# Altium project Drone Project.PrjPcb
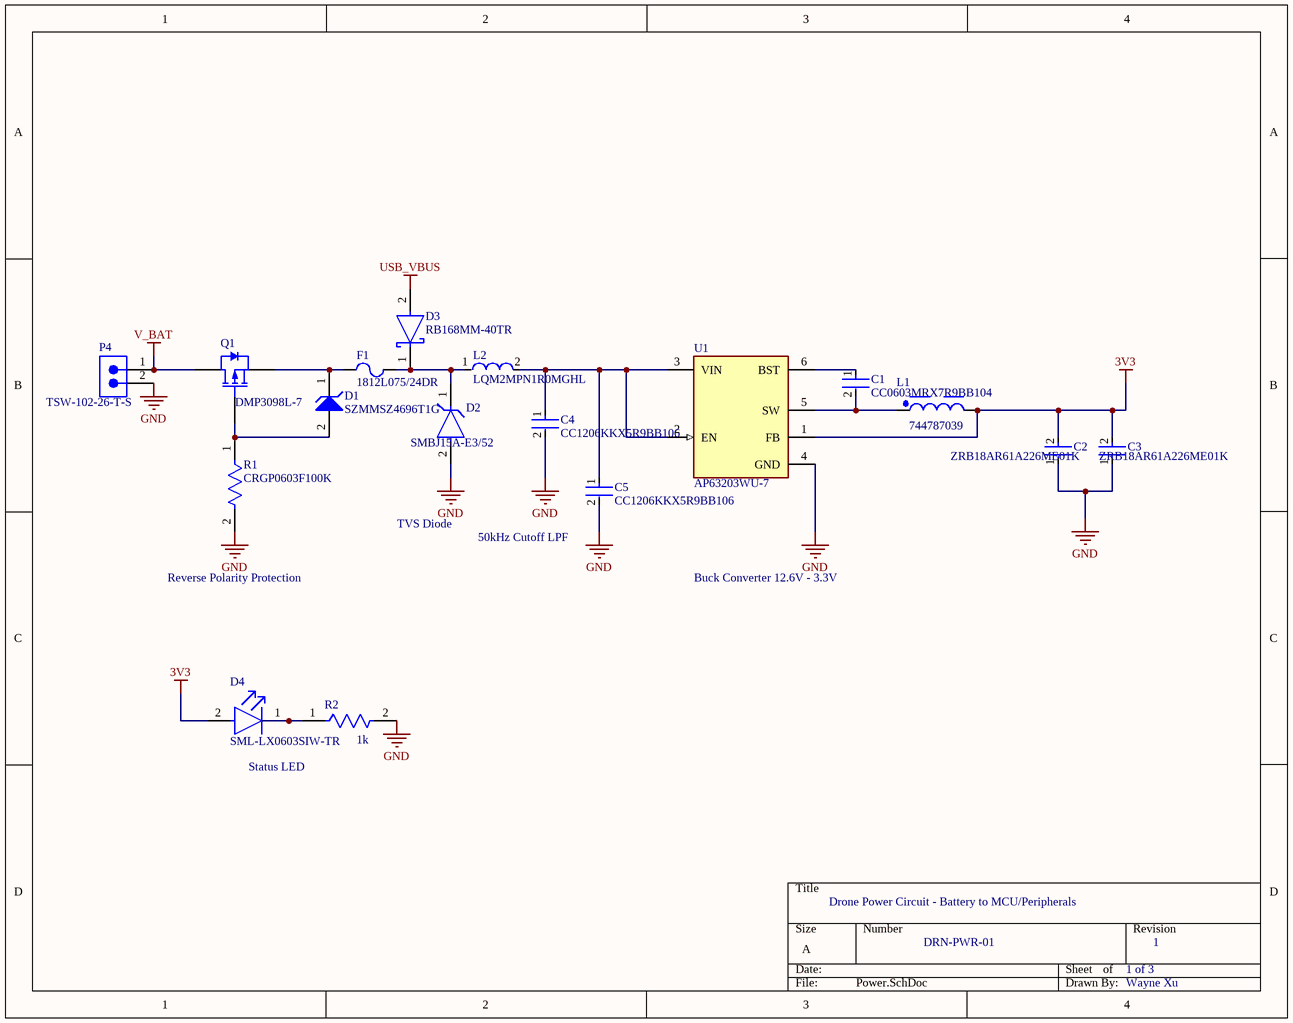
[diagram p0: Power.SchDoc]
3 sheets, 49 parts. Net scope: flat (ports and power ports of the same name join across sheets).
Board files: Drone Project.PcbDoc, PCB1.PcbDoc
Sheets:
  Power.SchDoc
  MCU.SchDoc
  Connectors.SchDoc

## Sheet Power.SchDoc
size A; SheetNumber: 1; SheetTotal: 3

### Parts
C1  CC0603MRX7R9BB104  [FP-CC0603-DA-MFG]
C2  ZRB18AR61A226ME01K  [FP-ZRB18A-0_2-MFG]
C3  ZRB18AR61A226ME01K  [FP-ZRB18A-0_2-MFG]
C4  CC1206KKX5R9BB106  [FP-CC1206-FD-MFG]
C5  CC1206KKX5R9BB106  [FP-CC1206-FD-MFG]
D1  SZMMSZ4696T1G  [ONSC-SOD-123-2-425-04_V]
D2  SMBJ15A-E3/52  [FP-95401-MFG]
D3  RB168MM-40TR  [FP-PMDU-MFG]
D4  SML-LX0603SIW-TR  [FP-SML-LX0603SIW-TR-MFG]
F1  1812L075/24DR  [LFUS-1812L07524DR_V]
L1  744787039  [WE-PD2SR_7850]
L2  LQM2MPN1R0MGHL  [FP-LQM2MPN_GH-MFG]
P4  TSW-102-26-T-S  [SMTC-TSW-102-26-XX-S]
Q1  DMP3098L-7  [DIOD-SOT23-3_V]
R1  CRGP0603F100K  [FP-CRGP0603-IPC_C]
R2  1k  [FP-CRGCQ0402-IPC_C]
U1  AP63203WU-7  [FP-TSOT26-MFG]

### Nets
3V3: C2.2 C3.2 D4.2(A) L1.2 U1.1(FB)
GND: C2.1 C3.1 C4.2 C5.2 D2.2(A) P4.2 R1.2 R2.2 U1.4(GND)
USB_VBUS: D3.2(A)
V_BAT: P4.1 Q1.3(D)
NetC1_1: C1.1 U1.6(BST)
NetC1_2: C1.2 L1.1 U1.5(SW)
NetC4_1: C4.1 C5.1 L2.2 U1.2(EN) U1.3(VIN)
NetD1_1: D1.1(K) F1.1 Q1.2(S)
NetD1_2: D1.2(A) Q1.1(G) R1.1
NetD2_1: D2.1(C) D3.1(C) F1.2 L2.1
NetD4_1: D4.1(C) R2.1

### Notes on the sheet
- TVS Diode
- (near C5) 50kHz Cutoff LPF
- Reverse Polarity Protection
- Buck Converter 12.6V - 3.3V
- Status LED
- Drone Power Circuit - Battery to MCU/Peripherals
- DRN-PWR-01
- 1 of 3
- 1
- Wayne Xu

### Library data of the parts
C1 = CMP-03422-000537-1: CAP CER 0.1UF 50V X7R 0603; Manufacturer: YAGEO; Material: Ceramic; Capacitance: 100 nF; Temperature Coefficient: 15%; Tolerance: 0.2; Value: 100 nF; Temperature Range Low: -55°C; Height: 0.9mm; Temperature Range High: +125°C; Category: Cap; Package: CC0603-DA; Mouser Description: Cap Ceramic 50V 20% +Tol 20% -Tol X7R 15% TC 0.1uF SMD 0603; Temperature Characteristic: X7R; Footprint Url: http://www.yageo.com/exep/pages/download/literatures/UPY-C_GEN_24.pdf; Octopart: https://octopart.com/cc0603mrx7r9bb104-yageo-67308423; RoHS: TRUE; Voltage: 50 V; Manufacturer Part Number: CC0603MRX7R9BB104; Lead Free: Yes; ComponentLink2URL: http://www.yageo.com/documents/recent/UPY-GPHC_X7R_6.3V-to-50V_18.pdf; ComponentLink2Description: Datasheet; Digikey Description: CAP CER 0.1UF 50V X7R 0603; Device Class L2: Capacitors; Automotive: No; Voltage Rating: 50 V; Temperature: -55°C to +125°C; Device Class L1: Passive Components; Device Class L3: Ceramic Capacitors
C2 C3 = CMP-06035-026751-1: CAP CER MLCC
C4 C5 = CMP-03422-001420-1: CAP CER 10UF 50V X5R 1206; Tolerance: 10%; Voltage Rating (DC): 50V; Width: 0.063inch; Halogen Free: Halogen Free; Mount: Surface Mount; Dielectric: X5R; Max Operating Temperature: 85°C; Capacitance: 10uF; Case/Package: 1206; Voltage Rating: 50V; Lead Free: Lead Free; Thickness: 0.075inch; Min Operating Temperature: -55°C; Length: 0.126inch; Packaging: Tape and Reel; RoHS Compliant: Yes
D1 = CMP-1060-00433-1: Zener Voltage Regulator, 500 mW, 2-Pin SOD-123, Pb-Free, Tape and Reel; Manufacturer: On Semiconductor; VZ Typ (V): 9.1; P Max (W): 0.5; PartNumber: SZMMSZ4696T1G; PackageVersion: Rev. G, 10/2009; ComponentLink1URL: http://www.onsemi.com/; ComponentLink1Description: Manufacturer URL; PackageDescription: 2-Pin SOD, Body 1.6 x 2.69 mm; ComponentLink2URL: http://www.onsemi.com/pub_link/Collateral/MMSZ4678T1-D.PDF; DatasheetVersion: Rev. 9; Packing: Tape and Reel; PackageReference: SOD-123-2-425-04; ComponentLink3URL: http://www.onsemi.com/pub_link/Collateral/425-04.PDF; ComponentLink2Description: Datasheet; RoHS: Pb-Free; Mounting Technology: Surface Mount; ComponentLink3Description: Package Specification
D2 = CMP-02577-000009-1: TVS DIODE 15V 24.4V DO214AA; Manufacturer: Vishay; Standoff Height: 0mm; Number Of Channels: 1; Max Junction Temp: +150°C; Breakdown Voltage: 16.7V; Peak Pulse Power: 600W; Peak Pulse Current: 24.6A; Direction: Unidirectional; Category: Diode; Reverse Standoff Voltage: 15V; Manufacturer Part Number: SMBJ15A-E3/52; Package: 95401; Temperature: -55°C to +150°C; Automotive: No; ComponentLink2Description: Datasheet; Temperature Range High: +150°C; ComponentLink2URL: https://www.vishay.com/docs/88392/smbj.pdf; Temperature Range Low: -55°C; Digikey Description: TVS DIODE 15V 24.4V DO214AA; Device Class L1: Circuit Protection; Mouser Description: TVS Diodes - Transient Voltage Suppressors 600W 15V 5% Uni; RoHS: TRUE; Device Class L2: TVS Diodes; Footprint Url: https://www.vishay.com/docs/95401/smb.pdf; Clamping Voltage: 24.4V; Octopart: https://octopart.com/smbj15a-e3%2F52-vishay-39558613; Lead Free: Yes; Device Class L3: unset; Height: 2.44mm
D3 = CMP-08971-000002-1: DIODE SCHOTTKY 40V 1A PMDU; Manufacturer: Rohm; Peak Reverse Current: 0.05uA; Max Surge Forward Current: 40A; Max Junction Temp: +150°C; ComponentLink2URL: https://www.rohm.com/datasheet/RB168MM-40/rb168mm-40tr-e; Manufacturer Part Number: RB168MM-40TR; Mouser Description: Schottky Diodes & Rectifiers 40V-VR 1A-IO 30A-IFSM; Reverse Voltage: 40V; Package: PMDU; Forward Current: 1A; Height: 0.9mm; Device Class L1: Discrete Semiconductors; Octopart: https://octopart.com/rb168mm-40tr-rohm-65063949; Digikey Description: DIODE SCHOTTKY 40V 1A PMDU; Lead Free: Yes; Temperature: to +150°C; RoHS: TRUE; Temperature Range High: +150°C; Max Repetitive Reverse Voltage: 40V; Device Class L2: Diodes; Automotive: No; Category: Diode; Device Class L3: Schottky Diodes; ComponentLink2Description: Datasheet
D4 = CMP-57192-000009-1: LED RED DIFFUSED SMD; Test Current: 20mA; Forward Voltage: 2V; Approvals: UL; Dominant Wavelength: 636nm; Viewing Angle: 140°; Lens Color: White; Luminous Intensity: 60mcd; Power Rating: 50mW; Number of LEDs: 1; Color: Red; Forward Current: 20mA; Moisture Sensitivity Level: 2; Case Code (Imperial): 0603; Lead Free: Lead Free; Lens Transparency: Diffused; Case Code (Metric): 1608; Height: 0.6mm; Max Operating Temperature: 85°C; Width: 0.8mm; Lens Style: Diffused; Illumination Color: Red; Wavelength: 636nm; REACH SVHC: No SVHC; Package Quantity: 1; RoHS Compliant: Yes; Case/Package: 0603; Number of Pins: 2; Packaging: Tape and Reel; Length: 1.6mm; Mount: Surface Mount; Min Operating Temperature: -25°C
F1 = CMP-2000-05510-1: Poly-Fuse(R) Resettable PTC, 24 V, 100 A, -40 to 85 degC, 2-Pin SMD, RoHS, Tape and Reel; Manufacturer: Littelfuse; Resistance: 290mOhms; Current Rating - Max: 100A; Maximum Voltage: 24VDC; Hold Current: 0.75A; Trip Current: 1.5A; Maximum Voltage DC: 24V; Type: PolyFuseResettablePTC; Datasheet Version: 02/2016; Package / Case: 1812(4532metric); Mounting Technology: SurfaceMount; Packaging: Reel; Package Description: 2-Pin Surface Mount Device, Body 4.55 x 3.24 mm; Brand: Littelfuse; Manufacturer URL: http://www.littelfuse.com/; Mounting Style: SMD/SMT; Dimensions: 4.37mmLx3.07mmWx0.75mmH; Operating Temperature Range: -40Cto+85C; Product Category: ResettableFuses-PPTC; Current Rating: 100A; Termination Style: SMD/SMT; Factory Pack Quantity: 1500; Current Rating (Max): 100A; Package Reference: 1812L07524DR; RoHS: Details; Series: 1812L; Datasheet URL: http://www.littelfuse.com/~/media/electronics/datasheets/resettable_ptcs/littelfuse_ptc_1812l_datasheet.pdf.pdf
L1 = CMP-1397-00011-3: Fixed Ind 3.9UH 3.8A 20 Mohm SMD; Core Material: Composite, Ferrite; Inductance: 3.9µH; Series Resistance: 16.7mΩ; Tolerance: 30%; Test Frequency: 100kHz; Shielding: Shielded; Self Resonant Frequency: 45MHz; Saturation Current: 4A; Number of Pins: 2; Max Operating Temperature: 125°C; Mount: Surface Mount; Length: 7.8mm; DC Resistance (DCR): 16.7mΩ; Case/Package: SMD/SMT; Min Operating Temperature: -40°C; Width: 7mm; REACH SVHC: Unknown; RMS Current (Irms): 3.8A; Max DC Current: 3.8A; Composition: Wirewound; Termination: SMD/SMT; Inductance Tolerance: 30%; Ambient Temperature Range High: 85°C; Ambient Temperature Range Low: -40°C; Depth: 7mm; Height - Seated (Max): 4.4958mm; RoHS: Compliant; Height: 4.8mm; Current Rating: 3.8A
L2 = CMP-06042-016377-1: FIXED IND 1UH 1.9A 80 MOHM SMD; Self Resonant Frequency: 60MHz; Tolerance: 20%; Shielding: Shielded; Saturation Current: 2A; Core Material: Ferrite; Test Frequency: 1MHz; DC Resistance (DCR): 80mR; Width: 1.6mm; Inductance: 1uH; Case Code (Metric): 2016; Package Quantity: 3000; Lead Free: Contains Lead; Height - Seated (Max): 0.039inch; Max Operating Temperature: 85°C; Height: 0.9mm; RoHS Compliant: Yes; Min Operating Temperature: -40°C; Length: 0.079inch; Case Code (Imperial): 0806; Packaging: Tape and Reel; Mount: Surface Mount; Case/Package: 0806; Max DC Current: 1.9A; Termination: SMD/SMT; Current Rating: 1.9A
P4 = CMP-1024-00328-1: 0.025" SQ Post Header, Through-hole, Vertical, -55 to 105 degC, 2.54 mm Pitch, 2-Pin, Male, RoHS; Manufacturer: Samtec; Pitch: 2.54 mm; PackageReference: TSW-102-26-XX-S; ComponentLink1URL: http://www.samtec.com; ComponentLink3Description: Package Specification; ComponentLink3URL: http://www.samtec.com/documents/webfiles/cpdf/TSW-XXX-XX-XXX-X-XX-XXX-MKT.pdf; DatasheetVersion: F-214; ComponentLink2URL: http://www.samtec.com/documents/webfiles/pdf/TSW_TH.PDF; Mounting Technology: Through-hole; ComponentLink2Description: Datasheet; PartNumber: TSW-102-26-T-S; ComponentLink1Description: Manufacturer URL; PackageDescription: .025[0.64] SQ. Post Terminal Strip Assembly; Orientation: Vertical; PackageVersion: DM, 8/1988; Temperature Range: -55 to 105 degC; RoHS: True
Q1 = CMP-0697-00001-2: P-Channel Enhancement Mode MOSFET, -30 V VDS, -55 to 155 degC, 3-Pin SOT23, RoHS, Tape and Reel; Manufacturer: Diodes Inc; PD (TA: 25 degC)=1.08 W; VGS: +/- 20 V; VDS: -30 V; IDS (TA: 25 degC)=-3.8 A; RDS(on) (Max.) (VGS: 4.5 V)=120 mOhm; VGS(th) (Max.): -2.1 V; ComponentLink3Description: Package Specification; ComponentLink3URL: http://www.diodes.com/datasheets/ap02002.pdf; PackageDescription: 3-Pin Small Outline Transistor, Body 1.3 x 2.9 mm, Pitch 0.95 mm; PackageReference: SOT23; PartNumber: DMP3098L-7; ComponentLink1Description: Manufacturer URL; ComponentLink2Description: Datasheet; ComponentLink2URL: http://www.diodes.com/datasheets/ds31447.pdf; ComponentLink1URL: http://www.diodes.com/; DatasheetVersion: Rev. 8 - 2; Mounting Technology: Surface Mount; RoHS: TRUE; Packing: Tape and Reel; PackageVersion: Rev. 75; Operating Temperature Range: -55 to 150 degC
R1 = CMP-03211-000885-1: CRGP 0603 100K 1%; Manufacturer: TE; Power Rating: 0.25W; Resistance: 100KΩ; Voltage Rating: 50V; Value: 100KΩ; Tolerance: 0.01; Temperature Coefficient: ±100ppm/°C; Device Class L2: Resistors; Temperature: -55°C to +155°C; Temperature Range High: +155°C; Ambient Temperature Range High: +70°C; Lead Free: Yes; RoHS: TRUE; Octopart: https://octopart.com/crgp0603f100k-te+connectivity-91018719; Digikey Description: CRGP 0603 100K 1%; Automotive: No; Manufacturer Part Number: CRGP0603F100K; ComponentLink2Description: Datasheet; Category: Res; Ipc Land Pattern Name: RESC16080X45; Device Class L3: Chip SMD Resistors; Composition: Thick Film; Temperature Range Low: -55°C; Height: 0.55mm; Device Class L1: Passive Components; Series: CRGP; Package: CRGP0603; ComponentLink2URL: https://www.te.com/commerce/DocumentDelivery/DDEController?Action=srchrtrv&DocNm=9-1773463-9&DocType=DS&DocLang=English
R2 = CMP-03211-006314-1: CRGCQ0402 1KΩ 1% ±100ppm/°C 50V; Manufacturer Part Number: CRGCQ0402F1K0; Manufacturer: TE Connectivity; Power Rating: 0.0625W; Tolerance: 0.01; Composition: Thick Film; Voltage Rating: 50V; Device Class L2: Resistors; Package: CRGCQ0402; Temperature Range High: +155°C; Device Class L3: Chip SMD Resistors; Automotive: Yes; Value: 1KΩ; Ambient Temperature Range High: +70°C; Temperature Range Low: -55°C; Temperature: -55°C to +155°C; Resistance: 1KΩ; Device Class L1: Passive Components; Height: 0.4mm; Series: CRGCQ; Lead Free: Yes; ComponentLink2URL: https://www.te.com/commerce/DocumentDelivery/DDEController?Action=showdoc&DocId=Data+Sheet%7F1773204-3%7F1%7Fpdf%7FEnglish%7FENG_DS_1773204-3_1.pdf%7F4-2176347-694; Category: Res; Octopart: https://octopart.com/crgcq0402f1k0-te+connectivity-91017946; RoHS: TRUE; ComponentLink2Description: Datasheet; Ipc Land Pattern Name: RESC10050X35; Temperature Coefficient: ±100ppm/°C
U1 = CMP-12757-000006-1: IC REG BUCK 3.3V 2A TSOT26; Manufacturer: Diodes Inc.; Output Type: Fixed; Min Supply Voltage: 3.8V; Number Of Outputs: 1; Max Junction Temp: +160°C; Nominal Supply Current: 22uA; Standoff Height: 0.01mm; Switching Frequency: 1.1MHz; Max Supply Voltage: 32V; ComponentLink2Description: Datasheet; Device Class L1: Integrated Circuits (ICs); Temperature: to +160°C; Device Class L3: Voltage Regulators - Switching; RoHS: TRUE; Octopart: https://octopart.com/ap63203wu-7-diodes+inc.-98099550; Output Voltage: 3.3V; Lead Free: Yes; ComponentLink2URL: https://www.diodes.com/assets/Datasheets/AP63200-AP63201-AP63203-AP63205.pdf; Digikey Description: IC REG BUCK 3.3V 2A TSOT26; Footprint Url: https://www.diodes.com/assets/Package-Files/TSOT26.pdf; Ambient Temperature Range High: +85°C; Height: 1mm; Automotive: No; Temperature Range High: +160°C; Switching Topology: Buck; Output Current: 2A; Package: TSOT26; Category: IC; Mouser Description: AP63203 Series 3.3 V 2 A SMT Fixed Low IQ Synchronous Buck - TSOT-26; Device Class L2: Power Management ICs; Ambient Temperature Range Low: -40°C; Manufacturer Part Number: AP63203WU-7

## Sheet MCU.SchDoc
size A; SheetNumber: 2; SheetTotal: 3
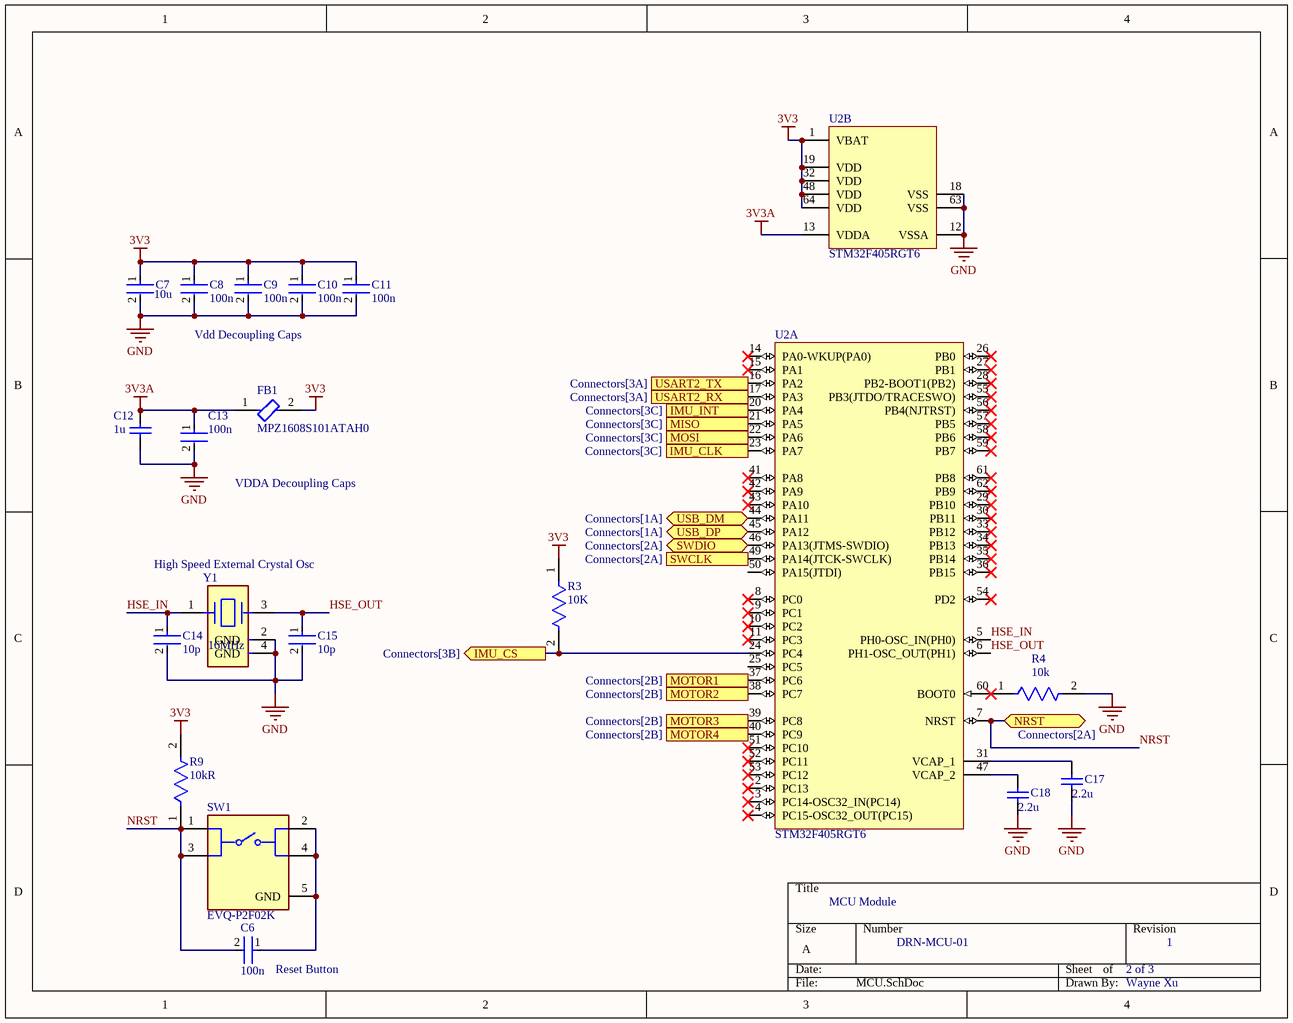
[diagram p1: MCU.SchDoc]

### Parts
C6  100n  [FP-C0603C-CF-MFG]
C7  10u  [FP-GRM155-0_2-MFG]
C8  100n  [FP-C0603C-CF-MFG]
C9  100n  [FP-C0603C-CF-MFG]
C10  100n  [FP-C0603C-CF-MFG]
C11  100n  [FP-C0603C-CF-MFG]
C12  1u  [CAPC2013X145X50LL20T25]
C13  100n  [FP-C0603C-CF-MFG]
C14  10p  [FP-C0603C-CF-MFG]
C15  10p  [FP-C0603C-CF-MFG]
C17  2.2u  [CAPC3216X180X50LL20T25]
C18  2.2u  [CAPC3216X180X50LL20T25]
FB1  MPZ1608S101ATAH0  [FP-MPZ1608-0_6-IPC_C]
R3  10K  [FP-AC0603-MFG]
R4  10k  [FP-AC0603-MFG]
R9  10kR  [FP-AC0603-MFG]
SW1  EVQ-P2F02K  [FP-EVQ-P2F02K-MFG]
U2  STM32F405RGT6  [STM-LQFP64_M]  (parts A,B of 2)
Y1  16MHz  [FP-ABM8W-MFG]

### Ports
IMU_CLK (out, see Connectors[3C]), IMU_CS (out, see Connectors[3B]), IMU_INT (in, see Connectors[3C]), MISO (in, see Connectors[3C]), MOSI (out, see Connectors[3C]), MOTOR1 (out, see Connectors[2B]), MOTOR2 (out, see Connectors[2B]), MOTOR3 (out, see Connectors[2B]), MOTOR4 (out, see Connectors[2B]), NRST (bidir, see Connectors[2A]), SWCLK (in, see Connectors[2A]), SWDIO (bidir, see Connectors[2A]), USART2_RX (in, see Connectors[3A]), USART2_TX (out, see Connectors[3A]), USB_DM (bidir, see Connectors[1A]), USB_DP (bidir, see Connectors[1A])

### Nets
3V3: C7.1 C8.1 C9.1 C10.1 C11.1 FB1.2 R3.1 R9.2 U2.1(VBAT) U2.19(VDD) U2.32(VDD) U2.48(VDD) U2.64(VDD)
3V3A: C12.1 C13.1 FB1.1 U2.13(VDDA)
GND: C7.2 C8.2 C9.2 C10.2 C11.2 C12.2 C13.2 C14.2 C15.2 C17.2 C18.2 R4.2 U2.12(VSSA) U2.18(VSS) U2.63(VSS) Y1.2(GND) Y1.4(GND)
HSE_IN: C14.1 U2.5(PH0-OSC_IN(PH0)) Y1.1
HSE_OUT: C15.1 U2.6(PH1-OSC_OUT(PH1)) Y1.3
NRST: C6.2 R9.1 SW1.1 SW1.3 U2.7(NRST) ; port NRST
NetC6_1: C6.1 SW1.2 SW1.4 SW1.5(GND)
NetC17_1: C17.1 U2.31(VCAP_1)
NetC18_1: C18.1 U2.47(VCAP_2)
NetP1_3: U2.49(PA14(JTCK-SWCLK)) ; port SWCLK
NetP1_4: U2.46(PA13(JTMS-SWDIO)) ; port SWDIO
NetP2_3: U2.16(PA2) ; port USART2_TX
NetP2_4: U2.17(PA3) ; port USART2_RX
NetP3_2: U2.40(PC9) ; port MOTOR4
NetP3_3: U2.39(PC8) ; port MOTOR3
NetP3_4: U2.38(PC7) ; port MOTOR2
NetP3_5: U2.37(PC6) ; port MOTOR1
NetR3_2: R3.2 U2.24(PC4) ; port IMU_CS
NetR4_1: R4.1 U2.60(BOOT0)
NetR5_2: U2.45(PA12) ; port USB_DP
NetR6_2: U2.44(PA11) ; port USB_DM
NetU2_20: U2.20(PA4) ; port IMU_INT
NetU2_21: U2.21(PA5) ; port MISO
NetU2_22: U2.22(PA6) ; port MOSI
NetU2_23: U2.23(PA7) ; port IMU_CLK

Not connected (* = marked no-connect by the designer): U2 2(PC13)* 3(PC14-OSC32_IN(PC14))* 4(PC15-OSC32_OUT(PC15))* 8(PC0)* 9(PC1)* 10(PC2)* 11(PC3)* 14(PA0-WKUP(PA0))* 15(PA1)* 25(PC5) 26(PB0)* 27(PB1)* 28(PB2-BOOT1(PB2))* 29(PB10)* 30(PB11)* 33(PB12)* 34(PB13)* 35(PB14)* 36(PB15)* 41(PA8)* 42(PA9)* 43(PA10)* 50(PA15(JTDI)) 51(PC10)* 52(PC11)* 53(PC12)* 54(PD2)* 55(PB3(JTDO/TRACESWO))* 56(PB4(NJTRST))* 57(PB5)* 58(PB6)* 59(PB7)* 61(PB8)* 62(PB9)*

### Notes on the sheet
- Vdd Decoupling Caps
- VDDA Decoupling Caps
- High Speed External Crystal Osc
- MCU Module
- (near C6) Reset Button
- DRN-MCU-01
- 2 of 3
- 1
- Wayne Xu

### Library data of the parts
C6 C8-C11 C13 = CMP-2006-03066-2: CAP CER 0.1UF 25V Y5V 0603; Manufacturer Part Number: C0603C104M3VACTU; Manufacturer: KEMET; Capacitance: 0.10 μF; Material: Ceramic; Temperature Coefficient: 30ppm/°C; Value: 0.10 μF; Automotive Grade: Grade 1; Tolerance: 0.2; Height: 0.87mm; Category: Cap; ComponentLink2Description: Datasheet; Temperature Range High: +125°C; Automotive: Yes; ComponentLink2URL: https://api.kemet.com/component-edge/download/datasheet/C0603C100J5GACAUTO.pdf; Mouser Description: Multilayer Ceramic Capacitors MLCC - SMD/SMT 25volts 0.1uF Y5V 20%; Device Class L2: Capacitors; Device Class L3: Ceramic Capacitors; Temperature: -55°C to +125°C; Lead Free: Yes; Temperature Range Low: -55°C; Package: C0603C-CF; RoHS: TRUE; Temperature Characteristic: Y5V; Octopart: https://octopart.com/c0603c104m3vactu-kemet-149363; Digikey Description: CAP CER 0.1UF 25V Y5V 0603; Voltage Rating: 25 V; Device Class L1: Passive Components
C7 = CMP-00260-135863761-1: GRM155D70G106ME18D SMD Chip Multilayer Ceramic Capacitor; Voltage Rating (DC): 4V; Dielectric: X7T; Capacitance: 10µF; Thickness: 500µm; Lifecycle Status: Production; Width: 500µm; Case/Package: 0402; NexarPartId: 135863761; Length: 1mm
C12 = CMP-1036-04746-2: Manufacturer: Kemet; Part Number: C0805C105K4PACTU
C14 C15 = CMP-03020-033857-1: CAP CER 10PF 100V C0G/NP0 0603; Manufacturer: KEMET; Manufacturer Part Number: C0603C100J1GACAUTO; Tolerance: 0.05; Temperature Coefficient: 30ppm/°C; Automotive Grade: Grade 1; Material: Ceramic; Temperature Characteristic: C0G; Temperature Range High: +125°C; Device Class L2: Capacitors; Value: 10 pF; Height: 0.87mm; Digikey Description: CAP CER 10PF 100V C0G/NP0 0603; RoHS: TRUE; Temperature Range Low: -55°C; Octopart: https://octopart.com/c0603c100j1gacauto-kemet-31033705; Voltage Rating: 100 V; ComponentLink2URL: https://api.kemet.com/component-edge/download/datasheet/C0603C100J5GACAUTO.pdf; Device Class L1: Passive Components; Automotive: Yes; ComponentLink2Description: Datasheet; Device Class L3: Ceramic Capacitors; Category: Cap; Temperature: -55°C to +125°C; Mouser Description: Cap Ceramic 10pF 100V C0G 5% Pad SMD 0603 125C Automotive T/R; Capacitance: 10 pF; Package: C0603C-CF; Lead Free: Yes
C17 C18 = CMP-1037-04812-2: Chip Capacitor, 2.2 uF, +/- 10%, 16 V, -55 to 125 degC, 1206 (3216 Metric), RoHS, Tape and Reel; Manufacturer: Kemet; Capacitance - nF: 2200nF; Voltage Rating DC: 16V; Class: Class1; Temperature Coefficient / Code: +/-15%; Case Height: 1mm; Dissipation Factor DF: 5; Capacitance: 2.2uF; Type: SMDMLCCX7R6.3-250VDCCommericalGrade; Case Width: 1.6mm; Dielectric: X7R; Case Length: 3.2mm; Series: C1206C; Tolerance: 10%; Datasheet URL: http://www.kemet.com/docfinder?Partnumber=C1206C106K8RACTU; Package Description: 2-Pin Surface Mount Device, Body 3.2 x 1.6 mm; RoHS: Details; Datasheet Version: 02/2016; Package / Case: 1206(3216metric); Case Code - mm: 3216; Packaging: Reel; Product Category: MultilayerCeramicCapacitorsMLCC-SMD/SMT; Package Reference: 1206; Maximum Operating Temperature: +125C; Mounting Technology: SurfaceMount; Dimensions: 1.6mmWx3.2mmLx1mmH; Case Code - in: 1206; Minimum Operating Temperature: -55C; Operating Temperature Range: -55Cto+125C; Brand: Kemet; Product: GeneralTypeMLCCs; Factory Pack Quantity: 2000; Voltage Rating: 16V; Termination Style: SMD/SMT; Manufacturer URL: http://www.kemet.com/
FB1 = CMP-08257-000005-2: FERRITE BEAD 100 OHM 0603 1LN; Max DC Current: 3A; Tolerance: 25%; Impedance: 100R; DC Resistance (DCR): 30mR; Packaging: Tape and Reel; Length: 0.063inch; Depth: 0.8mm; Current Rating: 3A; Mount: Surface Mount; Width: 0.031inch; Case Code (Imperial): 0603; Case Code (Metric): 1608; Height: 0.03inch; Core Material: Ferrite; REACH SVHC: No SVHC; Package Quantity: 4000; RoHS Compliant: Yes; Case/Package: 0603
R3 R4 R9 = CMP-03412-038553-1: RES 10kΩ 1.00% 0.2W 0603
SW1 = CMP-05618-000109-1: SWITCH TACTILE SPST-NO 0.02A 15V; Electrical Life: 200000Cycles; Contact Resistance: 100mR; Contact Current Rating: 20mA; Illumination Type: Non-Illuminated; Switch Travel: 0.7mm; Throw Configuration: SPST; Switch Function: Off-Mom; Actuator Type: Standard; Actuator Color: Black; Operating Force: 5N; Actuator Length: 0.85mm; Max Voltage Rating (DC): 15V; Radiation Hardening: No; Package Quantity: 1; Current Rating: 20mA; Max Operating Temperature: 85°C; Min Operating Temperature: -40°C; Max Current Rating: 20mA; Voltage Rating (DC): 15V; Depth: 5.5mm; Packaging: Tape and Reel; Mount: Surface Mount; Termination: J-Bend; Size: 3.5mm; Series: EVQP2; Length: 3.5mm; Lead Free: Lead Free; Orientation: Straight; RoHS Compliant: Yes; Mechanical Life: 200000Cycles
U2 = CMP-0243-00019-3: ARM Cortex-M4 32-bit MCU+FPU, 210 DMIPS, 1024 kB Flash, 192 kB Internal RAM, 51 I/Os, 64-pin LQFP, -40 to 85 degC, Tray; Manufacturer: STMicroelectronics; Supply Voltage(Vcc) min (V): 1.8; Supply Voltage(Vcc) max (V): 3.6; Internal RAM Size (kB): 192; I/Os (High Current): 51; D/A Converter: 2x12-bit; FLASH Size (Prog) (kB): 1024; Operating Frequency(F) (Processor speed) (MHz): 168; ComponentLink2Description: Datasheet; PackageVersion: Rev. 4, 06/2013; DatasheetVersion: Rev. 4; Core: ARM Cortex-M4; ComponentLink2URL: http://www.st.com/st-web-ui/static/active/en/resource/technical/document/datasheet/DM00037051.pdf; PackageReference: LQFP64; Packing: Tray; ComponentLink1Description: Manufacturer URL; ComponentLink3URL: http://www.st.com/st-web-ui/static/active/en/resource/technical/document/datasheet/DM00037051.pdf; ComponentLink3Description: Package Specification; Mounting Technology: Surface Mount; ComponentLink1URL: http://www.st.com/web/en/home.html; PackageDescription: 64-Pin Low Profile Quad Flat Package, 10 x 10 mm Body, 0.5 mm Pitch; PartNumber: STM32F405RGT6
Y1 = CMP-27762-014646-1: Crystal 16MHz ±10ppm (Tol) ±10ppm (Stability) 7pF FUND 70Ω 4-Pin SMD T/R

## Sheet Connectors.SchDoc
size A; SheetNumber: 3; SheetTotal: 3
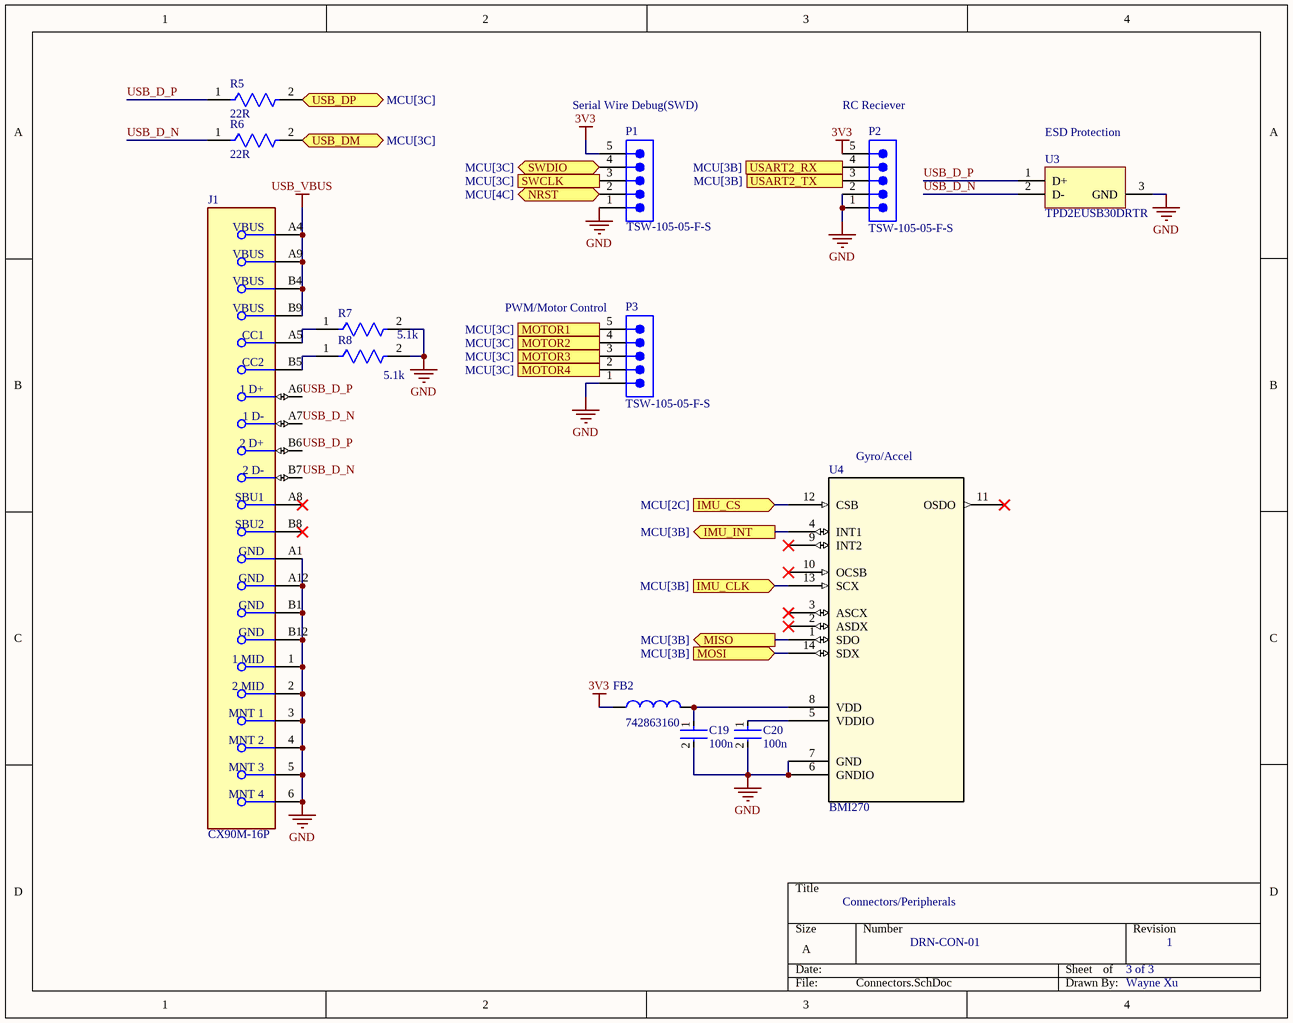
[diagram p2: Connectors.SchDoc]

### Parts
C19  100n  [FP-C0603C-CF-MFG]
C20  100n  [FP-C0603C-CF-MFG]
FB2  742863160  [WE-CBF HF_0603_HC]
J1  CX90M-16P  [FP-CX90M-16P-MFG]
P1  TSW-105-05-F-S  [SMTC-TSW-105-05-X-S]
P2  TSW-105-05-F-S  [SMTC-TSW-105-05-X-S]
P3  TSW-105-05-F-S  [SMTC-TSW-105-05-X-S]
R5  22R  [FP-CRGCQ0603-IPC_C]
R6  22R  [FP-CRGCQ0603-IPC_C]
R7  5.1k  [FP-RN73R1E-IPC_C]
R8  5.1k  [FP-RN73R1E-IPC_C]
U3  TPD2EUSB30DRTR  [DRT0003A]
U4  BMI270  [BMI270_BOS]

### Ports
IMU_CLK (in, see MCU[3B]), IMU_CS (in, see MCU[2C]), IMU_INT (out, see MCU[3B]), MISO (out, see MCU[3B]), MOSI (in, see MCU[3B]), MOTOR1 (in, see MCU[3C]), MOTOR2 (in, see MCU[3C]), MOTOR3 (in, see MCU[3C]), MOTOR4 (in, see MCU[3C]), NRST (bidir, see MCU[4C]), SWCLK (out, see MCU[3C]), SWDIO (bidir, see MCU[3C]), USART2_RX (out, see MCU[3B]), USART2_TX (in, see MCU[3B]), USB_DM (bidir, see MCU[3C]), USB_DP (bidir, see MCU[3C])

### Nets
3V3: FB2.1 P1.5 P2.5
GND: C19.2 C20.2 J1.1(1_MID) J1.2(2_MID) J1.3(MNT_1) J1.4(MNT_2) J1.5(MNT_3) J1.6(MNT_4) J1.A1(GND) J1.A12(GND) J1.B1(GND) J1.B12(GND) P1.1 P2.1 P2.2 P3.1 R7.2 R8.2 U3.3(GND) U4.6(GNDIO) U4.7(GND)
USB_VBUS: J1.A4(VBUS) J1.A9(VBUS) J1.B4(VBUS) J1.B9(VBUS)
NRST: P1.2 ; port NRST
USB_D_N: J1.A7(1_D-) J1.B7(2_D-) R6.1 U3.2(D-)
USB_D_P: J1.A6(1_D+) J1.B6(2_D+) R5.1 U3.1(D+)
NetC19_1: C19.1 FB2.2 U4.8(VDD)
NetC20_1: C20.1 U4.5(VDDIO)
NetJ1_A5: J1.A5(CC1) R7.1
NetJ1_B5: J1.B5(CC2) R8.1
NetP1_3: P1.3 ; port SWCLK
NetP1_4: P1.4 ; port SWDIO
NetP2_3: P2.3 ; port USART2_TX
NetP2_4: P2.4 ; port USART2_RX
NetP3_2: P3.2 ; port MOTOR4
NetP3_3: P3.3 ; port MOTOR3
NetP3_4: P3.4 ; port MOTOR2
NetP3_5: P3.5 ; port MOTOR1
NetR3_2: U4.12(CSB) ; port IMU_CS
NetR5_2: R5.2 ; port USB_DP
NetR6_2: R6.2 ; port USB_DM
NetU2_20: U4.4(INT1) ; port IMU_INT
NetU2_21: U4.1(SDO) ; port MISO
NetU2_22: U4.14(SDX) ; port MOSI
NetU2_23: U4.13(SCX) ; port IMU_CLK

Not connected (* = marked no-connect by the designer): J1 A8(SBU1)* B8(SBU2)*; U4 2(ASDX)* 3(ASCX)* 9(INT2)* 10(OCSB)* 11(OSDO)*

### Notes on the sheet
- (near P1) Serial Wire Debug(SWD)
- (near P2) RC Reciever
- (near U3) ESD Protection
- (near P3) PWM/Motor Control
- (near U4) Gyro/Accel
- Connectors/Peripherals
- DRN-CON-01
- 3 of 3
- 1
- Wayne Xu

### Library data of the parts
C19 C20 = CMP-2006-03066-2: as C6 on sheet MCU; Height: 0.87mm; Category: Cap; ComponentLink2Description: Datasheet; Temperature Range High: +125°C; Automotive: Yes; ComponentLink2URL: https://api.kemet.com/component-edge/download/datasheet/C0603C100J5GACAUTO.pdf; Mouser Description: Multilayer Ceramic Capacitors MLCC - SMD/SMT 25volts 0.1uF Y5V 20%; Device Class L2: Capacitors; Device Class L3: Ceramic Capacitors; Temperature: -55°C to +125°C; Lead Free: Yes; Temperature Range Low: -55°C; Package: C0603C-CF; RoHS: TRUE; Temperature Characteristic: Y5V; Octopart: https://octopart.com/c0603c104m3vactu-kemet-149363; Digikey Description: CAP CER 0.1UF 25V Y5V 0603; Voltage Rating: 25 V; Device Class L1: Passive Components
FB2 = CMP-0220-00101-3: Ferrite Bead (emi Suppression), 1.6X0.8X0.8MM (0603), 600O Impedance At 100 Mhz; Current Rating: 400mA; DC Resistance (DCR): 220mΩ; Max Current Rating: 500mA; Impedance: 600Ω; Tolerance: 25%; Resistance: 350mΩ; Number of Lines: 1; Test Frequency: 100MHz; Height: 800µm; Min Operating Temperature: -55°C; Length: 1.6mm; Width: 800µm; Case Code (Imperial): 0603; Depth: 800µm; Number of Pins: 2; Case Code (Metric): 1608; Case/Package: SMD/SMT; Lead Free: Lead Free; Core Material: Ferrite; Max Operating Temperature: 125°C; Termination: SMD/SMT; RoHS: Compliant; REACH SVHC: Unknown; Max DC Current: 500mA; Mount: Surface Mount
J1 = CMP-11601-000005-1: CONN RCPT USB2.0 TYPEC 16POS SMD; Connector Type: USB; Current Rating: 1.25A; Mating Cycles: 10000; Number of Contacts: 16; Gender: Receptacle; Shielding: Shielded; Number of Ports: 1; Insulation Color: Black; Termination: Solder; Min Operating Temperature: -30°C; Flammability Rating: UL94 V-0; Max Operating Temperature: 85°C; Packaging: Cut Tape; Contact Plating: Gold; Mount: Surface Mount
P1-P3 = CMP-1024-00365-1: 0.025" SQ Post Header, Through-hole, Vertical, -55 to 125 degC, 2.54 mm Pitch, 5-Pin, Male, RoHS; Manufacturer: Samtec; Pitch: 2.54 mm; PackageReference: TSW-105-05-X-S; ComponentLink1Description: Manufacturer URL; Temperature Range: -55 to 125 degC; ComponentLink2Description: Datasheet; ComponentLink2URL: http://www.samtec.com/documents/webfiles/pdf/TSW_TH.PDF; PartNumber: TSW-105-05-F-S; ComponentLink3URL: http://www.samtec.com/documents/webfiles/cpdf/TSW-XXX-XX-XXX-X-XX-XXX-MKT.pdf; ComponentLink1URL: http://www.samtec.com; DatasheetVersion: F-214; Mounting Technology: Through-hole; RoHS: True; PackageVersion: DM, 8/1988; ComponentLink3Description: Package Specification; PackageDescription: .025[0.64] SQ. Post Terminal Strip Assembly; Orientation: Vertical
R5 R6 = CMP-03211-006549-1: CRGCQ 0603 22R 1%; Manufacturer: TE Connectivity; Manufacturer Part Number: CRGCQ0603F22R; Voltage Rating: 75V; Power Rating: 0.1W; Value: 22Ω; Tolerance: 0.01; Temperature Coefficient: ±200ppm/°C; Category: Res; Lead Free: Yes; Device Class L3: Chip SMD Resistors; Ipc Land Pattern Name: RESC16080X45; Temperature Range Low: -55°C; RoHS: TRUE; Height: 0.55mm; Temperature Range High: +155°C; Composition: Thick Film; Octopart: https://octopart.com/crgcq0603f22r-te+connectivity-91018058; Device Class L1: Passive Components; Temperature: -55°C to +155°C; Device Class L2: Resistors; Series: CRGCQ; Mouser Description: SMD AEC-Q200 Compliant Thick Film Chip Resistor; Digikey Description: CRGCQ 0603 22R 1%; Ambient Temperature Range High: +70°C; ComponentLink2Description: Datasheet; Package: CRGCQ0603; ComponentLink2URL: https://www.te.com/commerce/DocumentDelivery/DDEController?Action=showdoc&DocId=Data+Sheet%7F1773204-3%7F1%7Fpdf%7FEnglish%7FENG_DS_1773204-3_1.pdf%7F4-2176339-310; Resistance: 22Ω
R7 R8 = CMP-04015-008529-1: 5.1kΩ ±1% 0.063W, 1/16W Chip Resistor 0402 (1005 Metric) Moisture Resistant Thin Film
U3 = CMP-0326-00046-3: ESD Solution for Super-Speed (6 Gbps) USB 3.0 Interface, 2 Channels, -40 to +85 degC, 3-pin SOT (DRT), Green (Rohs & No Sb/Br); Manufacturer: Texas Instruments; Differential Capacitance(pF): 0.01; Breakdown Voltage(Min)(V): 9; HDMI: TRUE; IEC 61000-4-2 Air-Gap(+/- kV): 8; IO Leakage Current(nA): 10; IO Capacitance(Typ)(pF): 0.7; Mounting Technology: Surface Mount; PackageDescription: 3-Flat Lead Plastic Small Outline, 1 x 1 mm (inc leads), 0.35 mm Pitch; IEC 61000-4-2 Contact(+/- kV): 8; USB Super Speed: TRUE; Eco-Plan: Green (RoHS & no Sb/Br); USB High Speed: TRUE; PackageReference: DRT0003A; SubFamily: ESD Solution; USB Full Speed: TRUE; ComponentLink1Description: Datasheet; ComponentLink2URL: SamplesURL:http://www.ti.com/product/tpd2eusb30#samples; PackageVersion: revD, Jun-2008; ComponentLink2Description: URL Link1; 1394 / Firewire: TRUE; PartNumber: TPD2EUSB30DRTR; ComponentLink1URL: http://www.ti.com/general/docs/lit/getliterature.tsp?genericPartNumber=TPD2EUSB30&fileType=pdf; DatasheetVersion: SLVSAC2C; Serial ATA / eSATA: TRUE
U4 = BMI270: Description; Manufacturer_Name: Bosch Sensortec; Copyright: Copyright (C) 2025 Ultra Librarian. All rights reserved.; Manufacturer_Part_Number: BMI270; RefDes: RefDes; Type: Type

## Nets that join several sheets
3V3: Power (5 pins), MCU (13 pins), Connectors (FB2.1 P1.5 P2.5)
GND: Power (9 pins), MCU (17 pins), Connectors (21 pins)
USB_VBUS: Power (D3.2), Connectors (J1.A4 J1.A9 J1.B4 J1.B9)
NetP1_3: MCU (U2.49), Connectors (P1.3)
NetP1_4: MCU (U2.46), Connectors (P1.4)
NetP2_3: MCU (U2.16), Connectors (P2.3)
NetP2_4: MCU (U2.17), Connectors (P2.4)
NetP3_2: MCU (U2.40), Connectors (P3.2)
NetP3_3: MCU (U2.39), Connectors (P3.3)
NetP3_4: MCU (U2.38), Connectors (P3.4)
NetP3_5: MCU (U2.37), Connectors (P3.5)
NetR3_2: MCU (R3.2 U2.24), Connectors (U4.12)
NetR5_2: MCU (U2.45), Connectors (R5.2)
NetR6_2: MCU (U2.44), Connectors (R6.2)
NetU2_20: MCU (U2.20), Connectors (U4.4)
NetU2_21: MCU (U2.21), Connectors (U4.1)
NetU2_22: MCU (U2.22), Connectors (U4.14)
NetU2_23: MCU (U2.23), Connectors (U4.13)
NRST: MCU (5 pins), Connectors (P1.2)